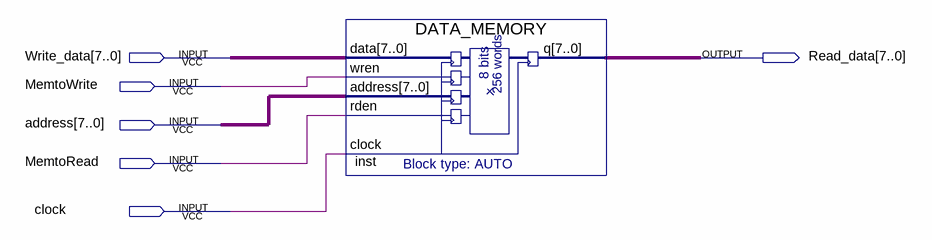
[diagram p0: schematic sheet]
// Quartus schematic Data_memory_diagram.bdf as structural Verilog: 1 symbols, 6 pins
module Data_memory_diagram (
  input  [7:0] Write_data,
  input  MemtoWrite,
  input  [7:0] address,
  input  MemtoRead,
  input  clock,
  output [7:0] Read_data
);

  DATA_MEMORY inst (
    .data(Write_data), .wren(MemtoWrite), .address(address), .rden(MemtoRead), .clock(clock), .q(Read_data));
endmodule
